# Altium schematic sheet [2]Diagram demo.SchDoc
size A4
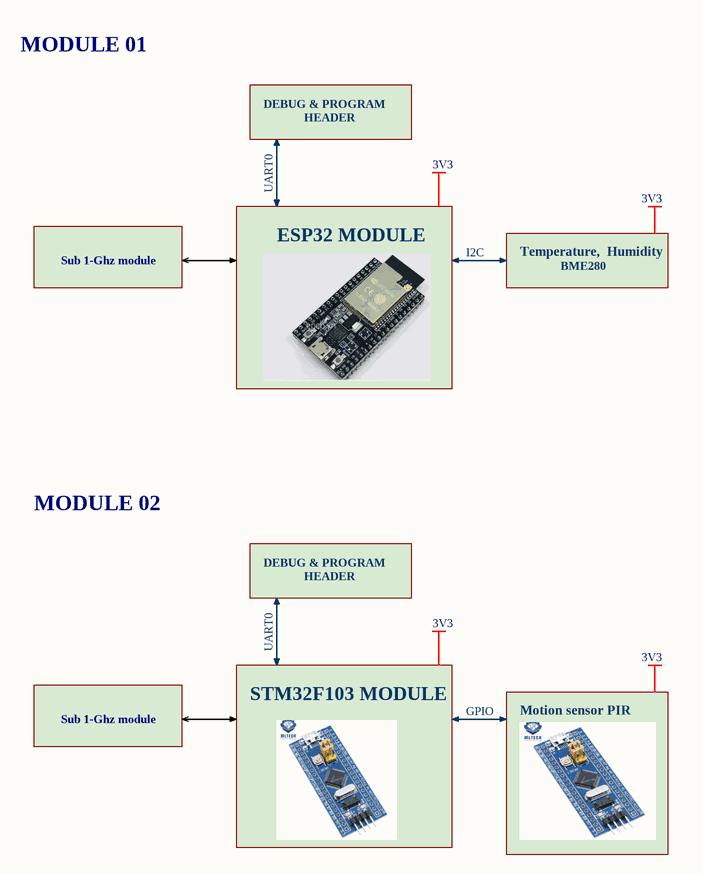
[diagram p0: [2]Diagram demo.SchDoc]

## Notes on the sheet
- MODULE 01
- DEBUG & PROGRAM
- HEADER
- UART0
- 3V3
- Sub 1-Ghz module
- ESP32 MODULE
- I2C
- Temperature,  Humidity
- BME280
- MODULE 02
- STM32F103 MODULE
- GPIO
- Motion sensor PIR